# Altium schematic sheet Power Supply.SchDoc
size 76 x 76 mm
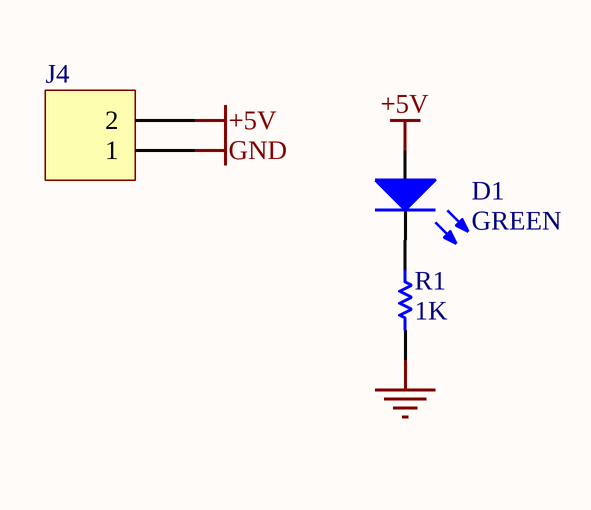
[diagram p0: Power Supply.SchDoc]

## Parts
D1  GREEN  [LED-5mm_Red]
J4  2PIN  [HDR1X2]  (value not drawn)
R1  1K  [0805]

## Nets
+5V: D1.1(A) J4.2
GND: J4.1 R1.2
NetD1_2: D1.2(K) R1.1

## Library data of the parts
D1 = LED: Typical INFRARED GaAs LED; Manufacturer: Generic Components; Class I: Optoelectronic; Published: 8-Jun-2000; Revision: July-2002: Re-released for DXP Platform.; Publisher: Altium Limited; Class II: LED
J4 = Header 2: Header, 2-Pin; Manufacturer: Generic Components; Class I: Connector; Revision: July-2002: Re-released for DXP Platform.; Publisher: Altium Limited
R1 = Res1: Resistor; Published: 8-Jun-2000; LatestRevisionDate: 17-Jul-2002; LatestRevisionNote: Re-released for DXP Platform.; PackageReference: AXIAL-0.3; Publisher: Altium Limited